# Altium schematic sheet Whitespace_Daughtercard_top_level.SchDoc: Daughtercard Top Level Schematic
size A; Author: Ryan E. Guerra; Revision: 1.0; SheetNumber: 1; SheetTotal: 10
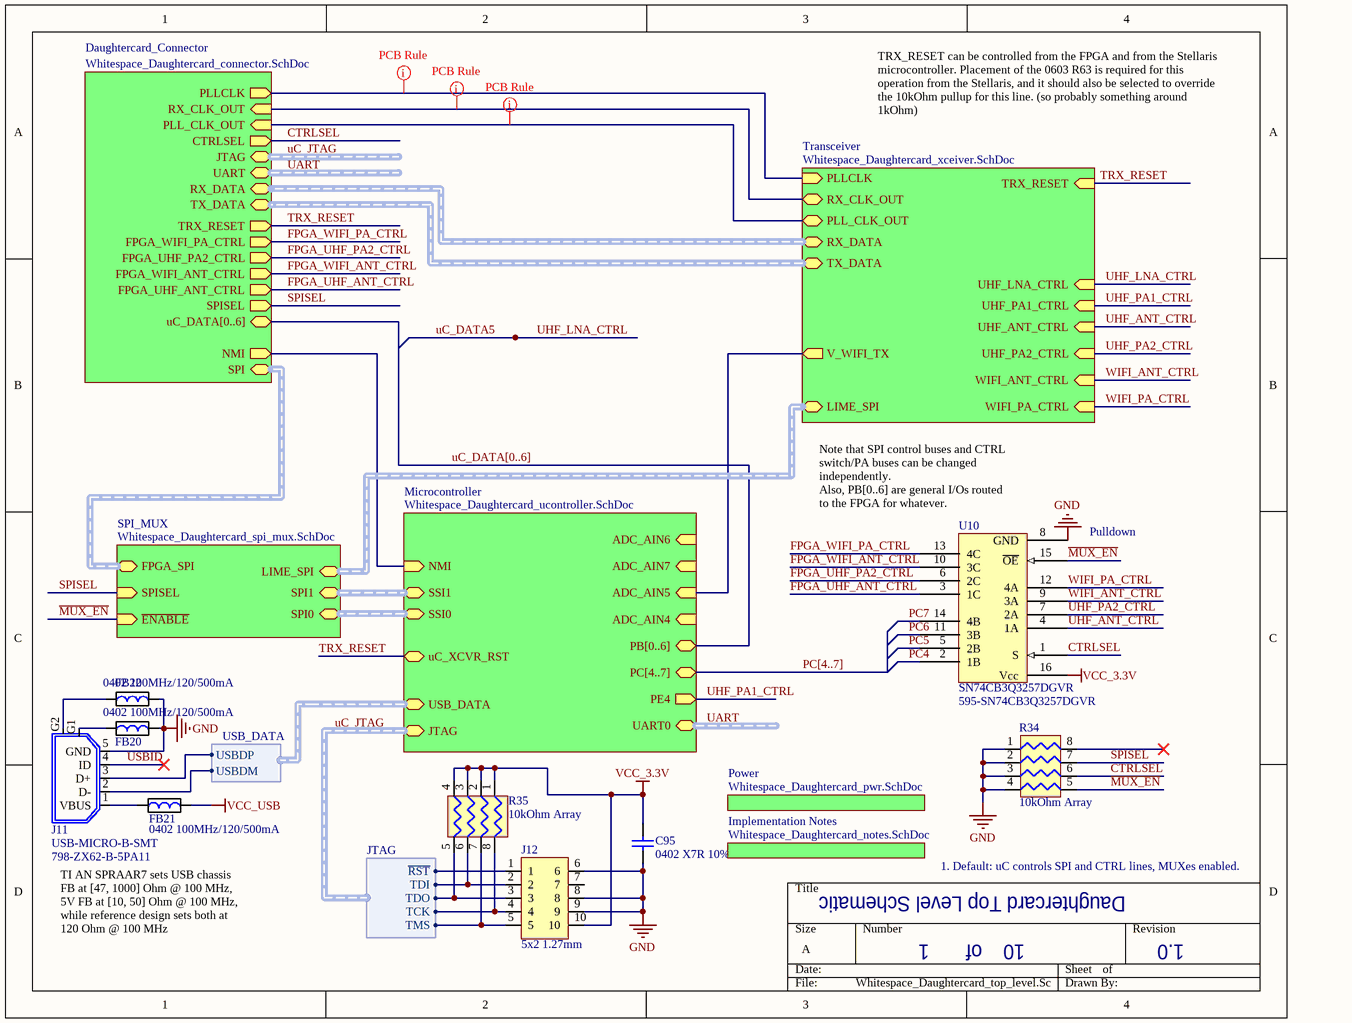
[diagram p0: Whitespace_Daughtercard_top_level.SchDoc]

## Parts
C95  0402 X7R 10%  [0402_SMT_V3]
FB20  0402 100MHz/120/500mA  [0402_SMT_v3]
FB21  0402 100MHz/120/500mA  [0402_SMT_v3]
FB22  0402 100MHz/120/500mA  [0402_SMT_v3]
J11  USB-MICRO-B-SMT  Supplier Part Number 1: 798-ZX62-B-5PA11  [USB_MICROB_SMT_R3]
J12  5x2 1.27mm  [1.27mm_2x5_SMT_HDR]
R34  10kOhm Array  [741X083_ChipArray_0402x4_v2]
R35  10kOhm Array  [741X083_ChipArray_0402x4_v2]
U10  SN74CB3Q3257DGVR  Supplier Part Number 1: 595-SN74CB3Q3257DGVR  [TVSOP16_v5]

## Sub-sheets
Daughtercard_Connector = Whitespace_Daughtercard_connector.SchDoc: NMI (out), uC_DATA[0..6], SPISEL (out), FPGA_UHF_ANT_CTRL (out), FPGA_WIFI_ANT_CTRL (out), FPGA_UHF_PA2_CTRL (out), FPGA_WIFI_PA_CTRL (out), SPI (harness SSI), JTAG (harness JTAG), RX_DATA (harness RX_DIG_DATA), TX_DATA (harness TX_DIG_DATA), UART (harness UART), TRX_RESET (out), RX_CLK_OUT (in), PLL_CLK_OUT (in), PLLCLK (out), CTRLSEL (out)
Implementation Notes = Whitespace_Daughtercard_notes.SchDoc: no entries
Microcontroller = Whitespace_Daughtercard_ucontroller.SchDoc: SSI0 (harness SSI), USB_DATA (harness USB_DATA), UART0 (harness UART), NMI (in), JTAG (harness JTAG), PB[0..6], PC[4..7], SSI1 (harness SSI), ADC_AIN6 (in), ADC_AIN7 (in), ADC_AIN5 (in), ADC_AIN4 (in), PE4 (out), uC_XCVR_RST
Power = Whitespace_Daughtercard_pwr.SchDoc: no entries
SPI_MUX = Whitespace_Daughtercard_spi_mux.SchDoc: SPI1 (harness SSI), SPI0 (harness SSI), FPGA_SPI (harness SSI), LIME_SPI (harness SSI), ~{ENABLE} (in), SPISEL (in)
Transceiver = Whitespace_Daughtercard_xceiver.SchDoc: V_WIFI_TX (out), RX_DATA (harness RX_DIG_DATA), TX_DATA (harness TX_DIG_DATA), UHF_ANT_CTRL (in), UHF_PA1_CTRL (in), UHF_PA2_CTRL (in), WIFI_ANT_CTRL (in), WIFI_PA_CTRL (in), TRX_RESET (in), PLLCLK (in), LIME_SPI (harness SSI), RX_CLK_OUT, PLL_CLK_OUT, UHF_LNA_CTRL (in)

## Harnesses
USB_DATA: USBDM, USBDP
JTAG: ~{RST}, TCK, TDI, TDO, TMS

## Nets
GND: C95.2 FB20.2 FB22.2 J11.5(GND) J12.6 J12.8 J12.9 R34.1 R34.2 R34.3 R34.4 U10.8(GND)
VCC_3.3V: C95.1 J12.10 R35.1 R35.2 R35.3 R35.4 U10.16(Vcc)
VCC_USB: FB21.2
~{MUX_EN}: R34.5 U10.15(~{OE}) ; sheet SPI_MUX/~{ENABLE}
CTRLSEL: R34.6 U10.1(S) ; sheet Daughtercard_Connector/CTRLSEL
FPGA_UHF_ANT_CTRL: U10.3(1C) ; sheet Daughtercard_Connector/FPGA_UHF_ANT_CTRL
FPGA_UHF_PA2_CTRL: U10.6(2C) ; sheet Daughtercard_Connector/FPGA_UHF_PA2_CTRL
FPGA_WIFI_ANT_CTRL: U10.10(3C) ; sheet Daughtercard_Connector/FPGA_WIFI_ANT_CTRL
FPGA_WIFI_PA_CTRL: U10.13(4C) ; sheet Daughtercard_Connector/FPGA_WIFI_PA_CTRL
PC4: U10.2(1B)
PC5: U10.5(2B)
PC6: U10.11(3B)
PC7: U10.14(4B)
SPISEL: R34.7 ; sheet Daughtercard_Connector/SPISEL, sheet SPI_MUX/SPISEL
TRX_RESET: sheet Daughtercard_Connector/TRX_RESET, sheet Transceiver/TRX_RESET, sheet Microcontroller/uC_XCVR_RST
uC_DATA5: sheet Transceiver/UHF_LNA_CTRL  [also labelled UHF_LNA_CTRL]
uC_JTAG~{.}RST: J12.1 ; sheet Daughtercard_Connector/JTAG.~{RST}
uC_JTAG.TCK: J12.4 R35.8 ; sheet Daughtercard_Connector/JTAG.TCK
uC_JTAG.TDI: J12.2 R35.6 ; sheet Daughtercard_Connector/JTAG.TDI
uC_JTAG.TDO: J12.3 R35.5 ; sheet Daughtercard_Connector/JTAG.TDO
uC_JTAG.TMS: J12.5 R35.7 ; sheet Daughtercard_Connector/JTAG.TMS
UHF_ANT_CTRL: U10.4(1A) ; sheet Transceiver/UHF_ANT_CTRL
UHF_PA1_CTRL: sheet Transceiver/UHF_PA1_CTRL, sheet Microcontroller/PE4
UHF_PA2_CTRL: U10.7(2A) ; sheet Transceiver/UHF_PA2_CTRL
USBID: J11.4(ID)
WIFI_ANT_CTRL: U10.9(3A) ; sheet Transceiver/WIFI_ANT_CTRL
WIFI_PA_CTRL: U10.12(4A) ; sheet Transceiver/WIFI_PA_CTRL
NetFB20_1: FB20.1 J11.G1(Chassis_Ground)
NetFB21_1: FB21.1 J11.1(VBUS)
NetFB22_1: FB22.1 J11.G2(Chassis_GND)
NetJ11_2: J11.2(D-) ; sheet Microcontroller/USB_DATA.USBDM
NetJ11_3: J11.3(D+) ; sheet Microcontroller/USB_DATA.USBDP
(unnamed): sheet Daughtercard_Connector/NMI, sheet Microcontroller/NMI
(unnamed): sheet Daughtercard_Connector/RX_CLK_OUT, sheet Transceiver/RX_CLK_OUT
(unnamed): sheet Daughtercard_Connector/PLL_CLK_OUT, sheet Transceiver/PLL_CLK_OUT
(unnamed): sheet Daughtercard_Connector/PLLCLK, sheet Transceiver/PLLCLK
(unnamed): sheet Transceiver/V_WIFI_TX, sheet Microcontroller/ADC_AIN5

Not connected (* = marked no-connect by the designer): J12 7; R34 8*

## Buses and harness runs
bus PC[4..7] = sheet Microcontroller/PC[4..7]
bus uC_DATA[0..6] = sheet Daughtercard_Connector/uC_DATA[0..6] = sheet Microcontroller/PB[0..6]
harness sheet Daughtercard_Connector/RX_DATA = sheet Transceiver/RX_DATA
harness sheet Daughtercard_Connector/SPI = sheet SPI_MUX/FPGA_SPI
harness sheet Daughtercard_Connector/TX_DATA = sheet Transceiver/TX_DATA
harness sheet Microcontroller/SSI0 = sheet SPI_MUX/SPI0
harness sheet Microcontroller/SSI1 = sheet SPI_MUX/SPI1
harness sheet SPI_MUX/LIME_SPI = sheet Transceiver/LIME_SPI
harness UART = sheet Daughtercard_Connector/UART
harness UART = sheet Microcontroller/UART0
harness uC_JTAG = sheet Daughtercard_Connector/JTAG
harness uC_JTAG = sheet Microcontroller/JTAG

## Layout directives
rule Impedance Constraint [Min = 49.00    Max = 51.00    ]: (no net found under the mark)

## Notes on the sheet
- TRX_RESET can be controlled from the FPGA and from the Stellaris microcontroller. Placement of the 0603 R63 is required for this operation from the Stellaris, and it should also be selected to override the 10kOhm pullup for this line. (so probably something around 1kOhm)
- (near U10) Note that SPI control buses and CTRL switch/PA buses can be changed independently.
  Also, PB[0..6] are general I/Os routed to the FPGA for whatever.
- Pulldown
- 1. Default: uC controls SPI and CTRL lines, MUXes enabled.
- TI AN SPRAAR7 sets USB chassis FB at [47, 1000] Ohm @ 100 MHz, 5V FB at [10, 50] Ohm @ 100 MHz, while reference design sets both at 120 Ohm @ 100 MHz
- of

## Library data of the parts
C95 = Cap: Capacitor; Value: 0.1uF; Published: 8-Jun-2000; LatestRevisionDate: 17-Jul-2002; LatestRevisionNote: Re-released for DXP Platform.; PackageReference: RAD-0.3; Publisher: Altium Limited; PackageDescription: Radial Cap, Thru-Hole; 2 Leads; 0.3 in Pin Spacing; Supplier 1: Mouser; Supplier Part Number 1: 810-C1005X7R1H104K
FB20-FB22 = FERRITE_BEAD: Ferrite Bead, Various Values; Supplier 1: Mouser; Supplier Part Number 1: 81-BLM15AG121SH1D
  FB20 FB22: Value: 0402 100MHz/120/500mA
J11 = USB-MICRO-B-SMT: Molex Micro-USB Type B Connector; Supplier 1: Mouser
J12 = Header_5x2_FinePitch_1.27mm: 5X2 1.27 SMT Header Pins; Supplier 1: Mouser; Supplier Part Number 1: 649-202112100010C4LF
R34 R35 = 741X083103JP: 10kOhm Ohm 4x0402 Resistor Array; Supplier 1: Mouser; Supplier Part Number 1: 774-741X083103JP
U10 = SN74CB3Q3257DGVR: 4-bit MUX/DEMUX 1-of-2  0-5V SIG 3.3V CTRL TVSOP-16; Supplier 1: Mouser